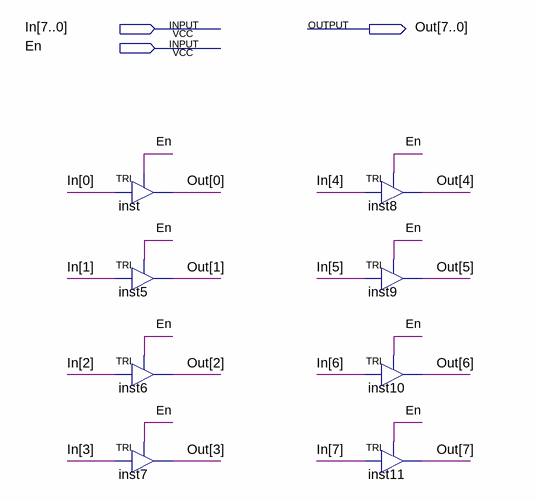
[diagram p0: schematic sheet]
// Quartus schematic 8BitTriStateBuffer.bdf as structural Verilog: 8 symbols, 3 pins
module \8BitTriStateBuffer  (
  input  [7:0] In,
  input  En,
  output [7:0] Out
);

  TRI inst (.IN(In[0]), .OE(En), .OUT(Out[0]));
  TRI inst5 (.IN(In[1]), .OE(En), .OUT(Out[1]));
  TRI inst6 (.IN(In[2]), .OE(En), .OUT(Out[2]));
  TRI inst7 (.IN(In[3]), .OE(En), .OUT(Out[3]));
  TRI inst8 (.IN(In[4]), .OE(En), .OUT(Out[4]));
  TRI inst9 (.IN(In[5]), .OE(En), .OUT(Out[5]));
  TRI inst10 (.IN(In[6]), .OE(En), .OUT(Out[6]));
  TRI inst11 (.IN(In[7]), .OE(En), .OUT(Out[7]));
endmodule
